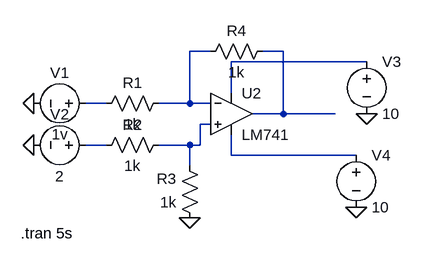
[diagram p0: schematic LM741DE.asc]
LM741DE.asc, the LTspice schematic file:
Version 4
SHEET 1 880 680
WIRE 128 80 96 80
WIRE 240 80 208 80
WIRE 368 96 160 96
WIRE 160 144 160 96
WIRE -32 160 -64 160
WIRE 96 160 96 80
WIRE 96 160 48 160
WIRE 128 160 96 160
WIRE 240 176 240 80
WIRE 240 176 192 176
WIRE 320 176 240 176
WIRE 128 192 112 192
WIRE -32 224 -64 224
WIRE 96 224 48 224
WIRE 112 224 112 192
WIRE 112 224 96 224
WIRE 160 240 160 208
WIRE 352 240 160 240
WIRE 96 256 96 224
FLAG -144 160 0
FLAG -144 224 0
FLAG 96 336 0
FLAG 368 176 0
FLAG 352 320 0
SYMBOL res 64 144 R90
WINDOW 0 0 56 VBottom 2
WINDOW 3 32 56 VTop 2
SYMATTR InstName R1
SYMATTR Value 1k
SYMBOL res 64 208 R90
WINDOW 0 0 56 VBottom 2
WINDOW 3 32 56 VTop 2
SYMATTR InstName R2
SYMATTR Value 1k
SYMBOL res 112 352 R180
WINDOW 0 36 76 Left 2
WINDOW 3 36 40 Left 2
SYMATTR InstName R3
SYMATTR Value 1k
SYMBOL res 112 96 R270
WINDOW 0 32 56 VTop 2
WINDOW 3 0 56 VBottom 2
SYMATTR InstName R4
SYMATTR Value 1k
SYMBOL voltage -48 160 R90
WINDOW 0 -32 56 VBottom 2
WINDOW 3 32 56 VTop 2
WINDOW 123 0 0 Left 0
WINDOW 39 0 0 Left 0
SYMATTR InstName V1
SYMATTR Value 1v
SYMBOL voltage -48 224 R90
WINDOW 0 -32 56 VBottom 2
WINDOW 3 32 56 VTop 2
WINDOW 123 0 0 Left 0
WINDOW 39 0 0 Left 0
SYMATTR InstName V2
SYMATTR Value 2
SYMBOL LM741 160 112 R0
SYMATTR InstName U2
SYMBOL voltage 368 80 R0
WINDOW 123 0 0 Left 0
WINDOW 39 0 0 Left 0
SYMATTR InstName V3
SYMATTR Value 10
SYMBOL voltage 352 224 R0
WINDOW 123 0 0 Left 0
WINDOW 39 0 0 Left 0
SYMATTR InstName V4
SYMATTR Value 10
TEXT -164 360 Left 2 !.tran 5s

The netlist it stands for:
* LM741DE.asc
R1 N001 N004 1k
R2 N005 N006 1k
R3 0 N005 1k
R4 N001 N002 1k
V1 N004 0 1v
V2 N006 0 2
XU2 N005 N001 N003 N007 N002 LM741  ; pins In+ In- V+ V- OUT
V3 N003 0 10
V4 N007 0 10
.tran 5s
.lib LM741.lib
.backanno
.end